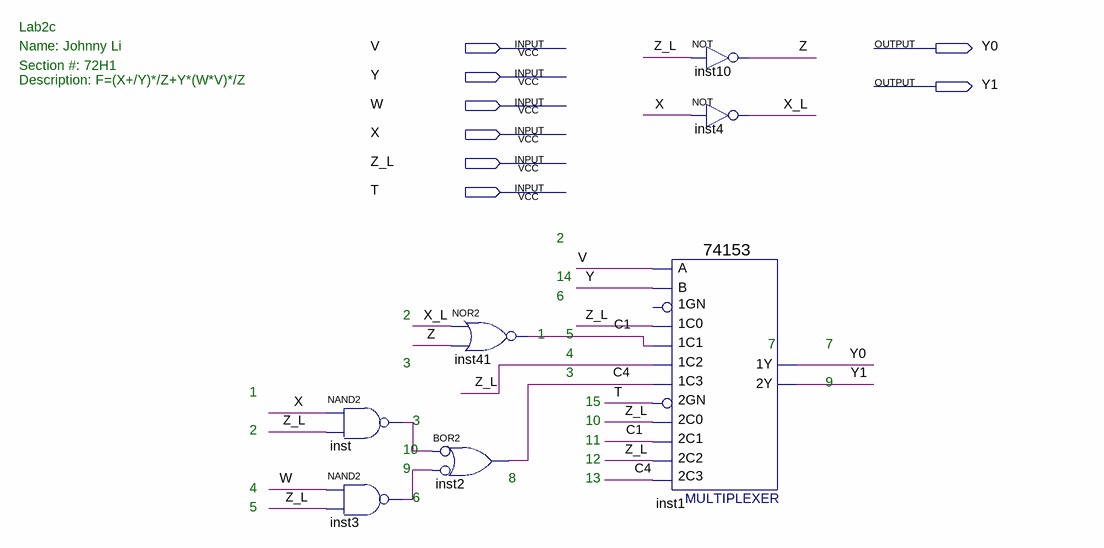
[diagram p0: schematic sheet]
// Quartus schematic lab2_EQU.bdf as structural Verilog: 7 symbols, 8 pins
module lab2_EQU (
  input  V,
  input  Y,
  input  W,
  input  X,
  input  Z_L,
  input  T,
  output Y0,
  output Y1
);

  wire C1, C4, inst3_out, inst_out, X_L, Z;

  nand inst (inst_out, X, Z_L);
  nand inst3 (inst3_out, W, Z_L);
  or inst2 (C4, ~inst_out, ~inst3_out);  // BOR2
  nor inst41 (C1, X_L, Z);
  \74153  inst1 (
    .\1C1 (C1), .\1C0 (Z_L), .\2C0 (Z_L), .\2GN (T), .\2C2 (Z_L), .\1C2 (Z_L), .\1C3 (C4), .B(Y), .A(V),
    .\2C1 (C1), .\2C3 (C4), .\1Y (Y0), .\2Y (Y1));  // open: 1GN
  not inst10 (Z, Z_L);
  not inst4 (X_L, X);

  // Notes on the sheet:
  //   Lab2c
  //   Name: Johnny Li
  //   Section #: 72H1
  //   Description: F=(X+/Y)*/Z+Y*(W*V)*/Z
  //   2
  //   14
  //   6
  //   2
  //   1
  //   5
  //   7
  //   7
  //   4
  //   3
  //   3
  //   9
  //   1
  //   15
  //   3
  //   10
  //   2
  //   11
  //   10
  //   12
  //   9
  //   8
  //   13
  //   4
  //   6
  //   5
endmodule
